# Altium project Exercise9_GPS.PrjPcb
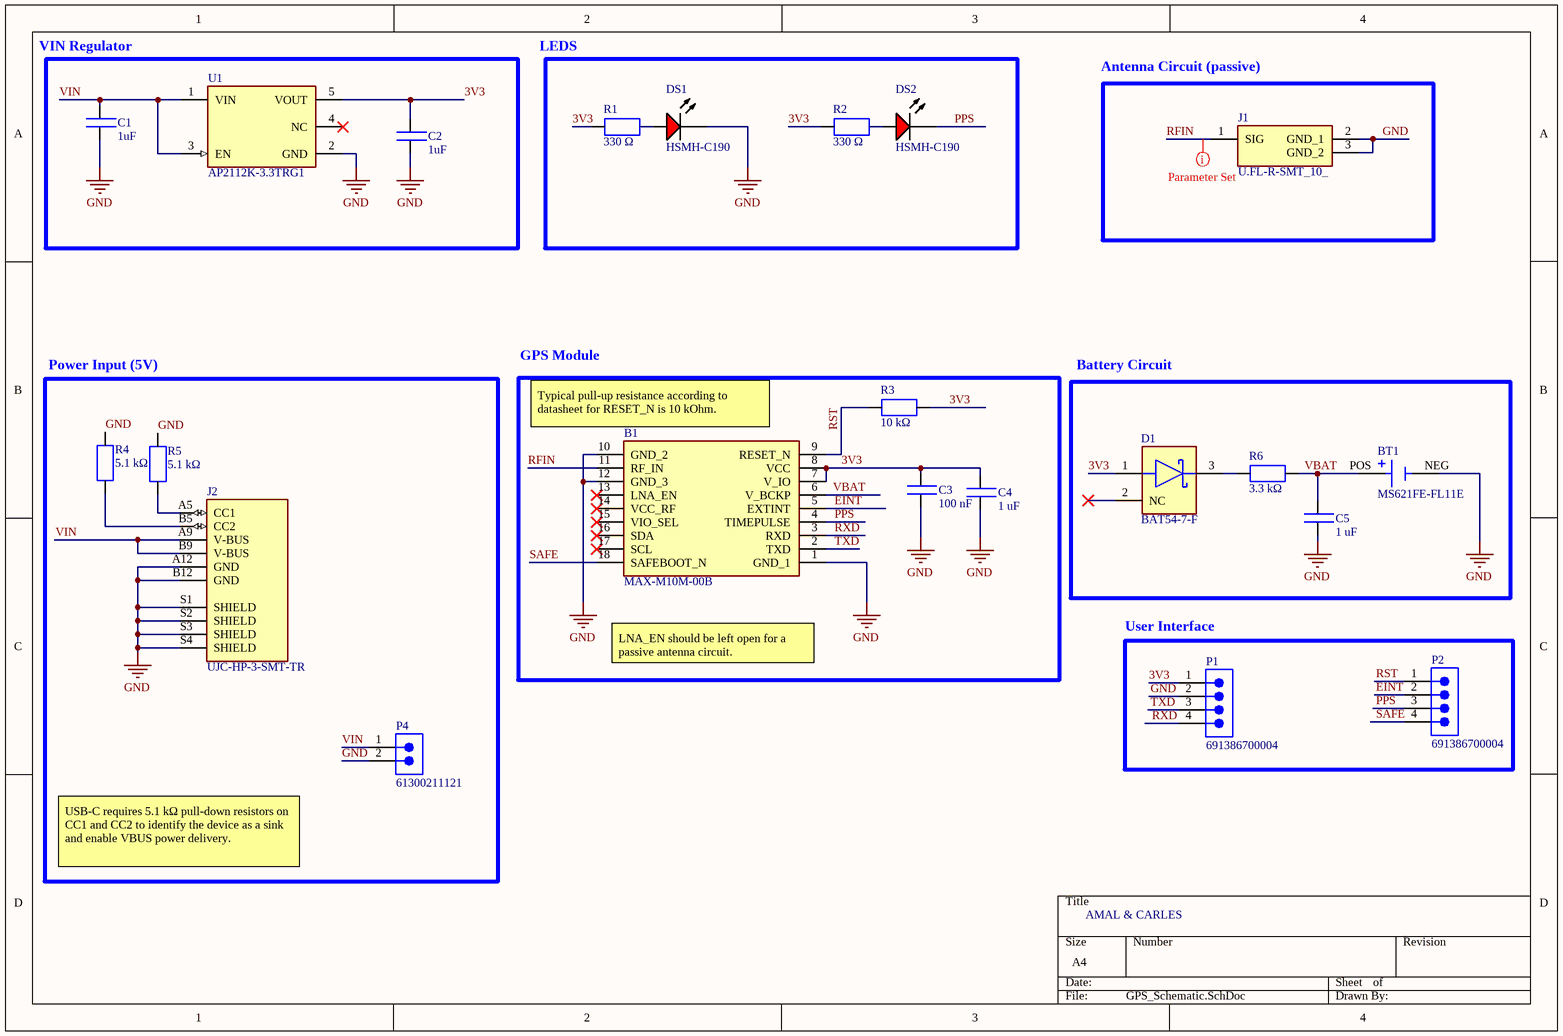
[diagram p0: GPS_Schematic.SchDoc]
1 sheet, 22 parts. Net scope: global (net labels, ports and power ports of the same name join across sheets).
Board file: GPS_PCB.PcbDoc

## Sheet GPS_Schematic.SchDoc
size A4; SheetNumber: 1; SheetTotal: 1

### Parts
B1  MAX-M10M-00B  [MAXM10M00B]
BT1  MS621FE-FL11E  [BAT_MS621FE-FL11E]
C1  1uF  [CAP_0402]
C2  1uF  [CAP_0402]
C3  100 nF  [CAP_0402]
C4  1 uF  [CAP_0402]
C5  1 uF  [CAP_0402]
D1  BAT54-7-F  [FP-SOT23-IPC_C]
DS1  HSMH-C190  [HSMH-C190]
DS2  HSMH-C190  [HSMH-C190]
J1  U.FL-R-SMT_10_  [UFLRSMT10]
J2  UJC-HP-3-SMT-TR  [CUI_UJC-HP-3-SMT-TR]
P1  691386700004  [CMP-1502-02092-3]
P2  691386700004  [CMP-1502-02092-3]
P4  61300211121  [61300211121]
R1  330 Ω  [RES_0402]
R2  330 Ω  [RES_0402]
R3  10 kΩ  [RES_0402]
R4  5.1 kΩ  [RES_0402]
R5  5.1 kΩ  [RES_0402]
R6  3.3 kΩ  [RES_0201]
U1  AP2112K-3.3TRG1  [FP-SOT25-IPC_C]

### Blocks framed on the sheet
VIN Regulator: C1 C2 U1
LEDS: DS1 DS2 R1 R2
Antenna Circuit (passive): J1
Power Input (5V): J2 P4 R4 R5
Battery Circuit: BT1 C5 D1 R6
User Interface: P1 P2

### Nets
GND: B1.1(GND_1) B1.10(GND_2) B1.12(GND_3) BT1.NEG C1.1 C2.1 C3.1 C4.1 C5.1 DS1.2(K) J1.2(GND_1) J1.3(GND_2) J2.A12(GND) J2.B12(GND) J2.S1(SHIELD) J2.S2(SHIELD) J2.S3(SHIELD) J2.S4(SHIELD) P1.2 P4.2 R4.1 R5.2 U1.2(GND)
3V3: B1.7(V_IO) B1.8(VCC) C2.2 C3.2 C4.2 D1.1(A) P1.1 R1.1 R2.1 R3.2 U1.5(VOUT)
EINT: B1.5(EXTINT) P2.2
PPS: B1.4(TIMEPULSE) DS2.2(K) P2.3
RFIN: B1.11(RF_IN) J1.1(SIG)
RST: B1.9(RESET_N) P2.1 R3.1
RXD: B1.3(RXD) P1.4
SAFE: B1.18(SAFEBOOT_N) P2.4
TXD: B1.2(TXD) P1.3
VBAT: B1.6(V_BCKP) BT1.POS C5.2 R6.2
VIN: C1.2 J2.A9(V-BUS) J2.B9(V-BUS) P4.1 U1.1(VIN) U1.3(EN)
NetD1_3: D1.3(C) R6.1
NetDS1_1: DS1.1(A) R1.2
NetDS2_1: DS2.1(A) R2.2
NetJ2_A5: J2.A5(CC1) R5.1
NetJ2_B5: J2.B5(CC2) R4.2

Not connected (* = marked no-connect by the designer): B1 13(LNA_EN)* 14(VCC_RF)* 15(VIO_SEL)* 16(SDA)* 17(SCL)*; D1 2(NC)*; U1 4(NC)*

### Layout directives
net class RF: RFIN

### Notes on the sheet
- GPS Module
- (near B1) Typical pull-up resistance according to datasheet for RESET_N is 10 kOhm.
- LNA_EN should be left open for a passive antenna circuit.
- USB-C requires 5.1 kΩ pull-down resistors on CC1 and CC2 to identify the device as a sink and enable VBUS power delivery.
- AMAL & CARLES

### Library data of the parts
B1 = MAX-M10M-00B: GPS Modules u-blox M10 GNSS LCC module, firmware in ROM, crystal oscillator; Geometry.Height: 2.7mm; Manufacturer_Name: u-blox; Manufacturer_Part_Number: MAX-M10M-00B; Mouser Part Number: 377-MAX-M10M-00B; Mouser Price/Stock: https://www.mouser.co.uk/ProductDetail/u-blox/MAX-M10M-00B?qs=A6eO%252BMLsxmQGh8%2FJ1ZmexA%3D%3D; Arrow Part Number: MAX-M10M-00B; Arrow Price/Stock: https://www.arrow.com/en/products/max-m10m-00b/u-blox?utm_currency=USD&region=nac; Datasheet Link: https://content.u-blox.com/sites/default/files/documents/MAX-M10M_IntegrationManual_UBX-22038241.pdf
BT1 = MS621FE-FL11E: Coin, 6.8mm 3 V Lithium Battery Rechargeable (Secondary) 5.5mAh; MF: Seiko Instruments; Value: *; Purchase-URL: https://pricing.snapeda.com/search/part/MS621FE-FL11E/?ref=eda; Package: QFP-128 Seiko; Availability: In Stock; Check_prices: https://www.snapeda.com/parts/MS621FE-FL11E/Seiko+Instruments/view-part/?ref=eda; Price: None; SnapEDA_Link: https://www.snapeda.com/parts/MS621FE-FL11E/Seiko+Instruments/view-part/?ref=snap; MP: MS621FE-FL11E
C1-C5 = CAP_0402: Capacitor SMD 0402 Generic; Manufacturer: YAGEO; Manufacturer Part Number: CC0402JRNPO9BN101; Capacitance: 100 pF; Tolerance: 5%; LCSC Part Number: C106200
D1 = CMP-0303-00002-2: DIODE SCHOTTKY 30V 200MA SOT23-3; Manufacturer: Diodes Inc.; Value: 10pF; Automotive Grade: NA; Max Junction Temp: +150°C; Peak Reverse Current: 2uA; Max Surge Forward Current: 600mA; Standoff Height: 0.013mm; Max Repetitive Reverse Voltage: 30V; Automotive: No; Package: SOT23; Category: Diode; Digikey Description: DIODE SCHOTTKY 30V 200MA SOT23-3; RoHS: TRUE; Temperature Range Low: -65°C; Device Class L3: Schottky Diodes; Footprint Url: https://www.diodes.com/assets/Package-Files/SOT23.pdf; Forward Current: 200mA; Reverse Voltage: 30V; Manufacturer Part Number: BAT54-7-F; Octopart: https://octopart.com/bat54-7-f-diodes+inc.-39681803; Lead Free: Yes; Temperature Range High: +150°C; ComponentLink2Description: Datasheet; Height: 1.1mm; Capacitance: 10pF; ComponentLink2URL: https://www.diodes.com/assets/Datasheets/ds11005.pdf; Temperature: -65°C to +150°C; Device Class L1: Discrete Semiconductors; Device Class L2: Diodes; Mouser Description: Switching diode SOT-23 30 V 200 mA | Diodes Incorporated BAT547F (Switching diode SOT-23 30 V 200 mA Diodes).
DS1 DS2 = HSMH-C190: LED Uni-Color Red, 65 mW, 20 mA, -40 to 85 degC, 2-Pin SMD, RoHS, Tape and Reel; Connector Type: USB; Gender: Male; Current Rating: 1 A; Length: 7.5 mm; Lead Pitch: 0.65 mm; PackageReference: HSMX-C190; Package Quantity: 2000; Max Operating Temperature: 85 degC; PackageDescription: 2-Pin Surface Mount Device, Body 1.6 x 0.8 mm, Height 0.9 mm; ComponentLink3Description: Package Specification; Mount: Surface Mount; Min Operating Temperature: -30 degC; ComponentLink3URL: http://www.fairchildsemi.com/dwg/MA/MA03D.pdf; ComponentLink1Description: Manufacturer URL; Contact Material: Copper; Pins: 5; Width: 5.6 mm; ComponentLink2Description: Datasheet; RoHSCompliant: true; DatasheetVersion: Mar-12; Height: 2.8 mm; Packaging: Tape and Reel; Contact Plating: Gold; ComponentLink1URL: http://www.avagotech.com/; REACH SVHC: No SVHC; ComponentLink2URL: http://docs.avagotech.com/docs/AV02-0551EN
J1 = U.FL-R-SMT_10_: U.FL (UMCC) Connector Receptacle, Male Pin 50 Ohms Surface Mount Solder; Manufacturer_Name: Hirose; Manufacturer_Part_Number: U.FL-R-SMT(10); Geometry.Height: 1.45mm; Mouser Part Number: 798-U.FL-R-SMT10; Mouser Price/Stock: https://www.mouser.co.uk/ProductDetail/Hirose-Connector/U.FL-R-SMT10?qs=Ux3WWAnHpjBT1CWD8UMEMQ%3D%3D; Arrow Part Number: U.FL-R-SMT(10); Arrow Price/Stock: https://www.arrow.com/en/products/u.fl-r-smt-10/hirose-electric?utm_currency=USD&region=nac; Datasheet Link: https://eu.mouser.com/datasheet/2/185/hiros05388_1-2269186.pdf
P1 P2 = CMP-1502-02092-3: Terminal Block, 5.00MM, Male Pcb Horizontal/vertical Cab Divisible, 4 Pins; Number of Levels: 1; Number of Positions: 4; Current: 14A; Voltage: 300V; Pitch: 5.0038mm; Mount: Through Hole; Max Operating Temperature: 130°C; Lead Pitch: 5mm; Number of Positions Per Level: 4; Packaging: Box; Color: Grey; Min Operating Temperature: -30°C; RoHS: Compliant; Orientation: Vertical; Number of Pins: 4; Termination: Solder
P4 = CMP-1712-00002-7: THT Vertical Pin Header WR-PHD, Pitch 2.54 mm, Single Row, 2 pins; Pitch: 2.54mm; Number of Contacts: 2; Connector Type: Male Pin; Gender: Male; Contact Resistance: 20mΩ; Operating Supply Voltage: 250V; Current Rating: 3A; Housing Material: PBT; RoHS: Compliant; Lead Free: Lead Free; Contact Material: Gold; REACH SVHC: No; Min Operating Temperature: -40°C; Termination: Through Hole; Number of Pins: 2; Contact Gender: Male; Packaging: Bulk; Lead Pitch: 2.54mm; Contact Plating: Gold; Orientation: Vertical; Mount: Through Hole; Height: 8.94mm; Color: Black; Number of Positions: 2; Contact Mating Length: 5.9944mm; Max Operating Temperature: 105°C; Voltage Rating: 250V; Number of Rows: 1
R1-R5 = RES_0402: Resistor SMD 0402 Generic; Manufacturer: YAGEO; Manufacturer Part Number: RC0402FR07150KL; Tolerance: 1%; Resistance: 150 kOhm; LCSC Part Number: C93947
R6 = RES_0201: Resistor SMD 0201 Generic; Manufacturer: YAGEO; Manufacturer Part Number: RT0201BRD07200RL; Tolerance: 0.1%; Resistance: 200 Ohm; LCSC Part Number: C852221
U1 = CMP-12756-000035-1: IC REG LINEAR 3.3V 600MA SOT25; Number of Regulators: 1; Output Type: Fixed; Polarity: Positive; Min Input Voltage: 2.5V; Max Input Voltage: 6V; Accuracy: 1.5%; Quiescent Current: 55uA; Dropout Voltage: 250mV; Min Operating Temperature: -40°C; Length: 3.1mm; Output Current: 600mA; Max Operating Temperature: 85°C; Package Quantity: 1; Output Voltage: 3.3V; Width: 1.7mm; Number of Outputs: 1; Packaging: Tape and Reel; Height: 1.3mm; Lead Free: Lead Free; Max Output Current: 600mA; Case/Package: SOT-23-5; Mount: Surface Mount; Number of Pins: 5
J2 = UJC-HP-3-SMT-TR: Package: None; Price: None; Value: *; MP: UJC-HP-3-SMT-TR; Availability: Unavailable